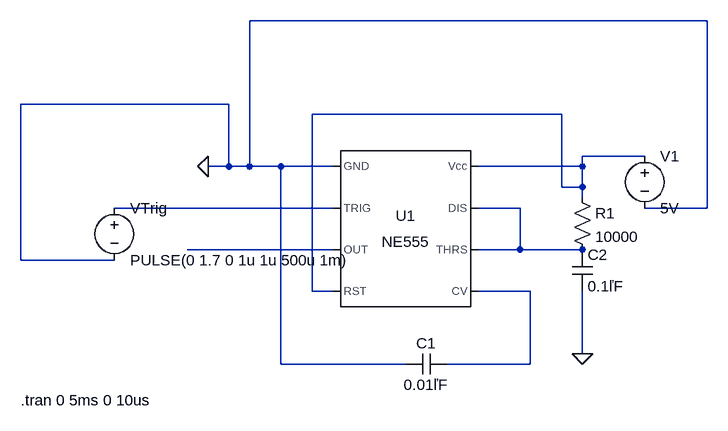
[diagram p0: schematic IC555 Monostable.asc]
IC555 Monostable.asc, the LTspice schematic file:
Version 4.1
SHEET 1 880 680
WIRE 608 -144 -96 -144
WIRE -128 -16 -448 -16
WIRE 384 0 0 0
WIRE 512 64 416 64
WIRE -128 80 -128 -16
WIRE -128 80 -160 80
WIRE -96 80 -96 -144
WIRE -96 80 -128 80
WIRE -48 80 -96 80
WIRE 32 80 -48 80
WIRE 416 80 416 64
WIRE 416 80 256 80
WIRE 384 112 384 0
WIRE 416 112 416 80
WIRE 416 112 384 112
WIRE 416 128 416 112
WIRE 32 144 -304 144
WIRE 320 144 256 144
WIRE 608 144 608 -144
WIRE 608 144 512 144
WIRE 32 208 -192 208
WIRE 320 208 320 144
WIRE 320 208 256 208
WIRE 416 208 320 208
WIRE -448 224 -448 -16
WIRE -304 224 -448 224
WIRE 0 272 0 0
WIRE 32 272 0 272
WIRE 336 272 256 272
WIRE 416 368 416 272
WIRE -48 384 -48 80
WIRE 144 384 -48 384
WIRE 336 384 336 272
WIRE 336 384 208 384
FLAG -160 80 0
FLAG 416 368 0
SYMBOL Misc\\NE555 144 176 R0
SYMATTR InstName U1
SYMBOL cap 208 368 R90
WINDOW 0 0 32 VBottom 2
WINDOW 3 32 32 VTop 2
SYMATTR InstName C1
SYMATTR Value 0.01ľF
SYMBOL voltage 512 48 R0
WINDOW 123 0 0 Left 0
WINDOW 39 0 0 Left 0
SYMATTR InstName V1
SYMATTR Value 5V
SYMBOL res 400 112 R0
SYMATTR InstName R1
SYMATTR Value 10000
SYMBOL voltage -304 128 R0
WINDOW 123 0 0 Left 0
WINDOW 39 0 0 Left 0
SYMATTR InstName VTrig
SYMATTR Value PULSE(0 1.7 0 1u 1u 500u 1m)
SYMBOL cap 400 208 R0
SYMATTR InstName C2
SYMATTR Value 0.1ľF
TEXT -448 440 Left 2 !.tran 0 5ms 0 10us

The netlist it stands for:
* IC555 Monostable.asc
X§U1 0 N002 N004 N001 N005 N003 N003 N001 NE555  ; pins GND TRIG OUT RST CV THRS DIS Vcc
C1 N005 0 0.01ľF
V1 N001 0 5V
R1 N001 N003 10000
VTrig N002 0 PULSE(0 1.7 0 1u 1u 500u 1m)
C2 N003 0 0.1ľF
.tran 0 5ms 0 10us
.lib NE555.sub
.backanno
.end